# Altium schematic sheet Shifter.SchDoc
size B; SheetNumber: 2; SheetTotal: 2
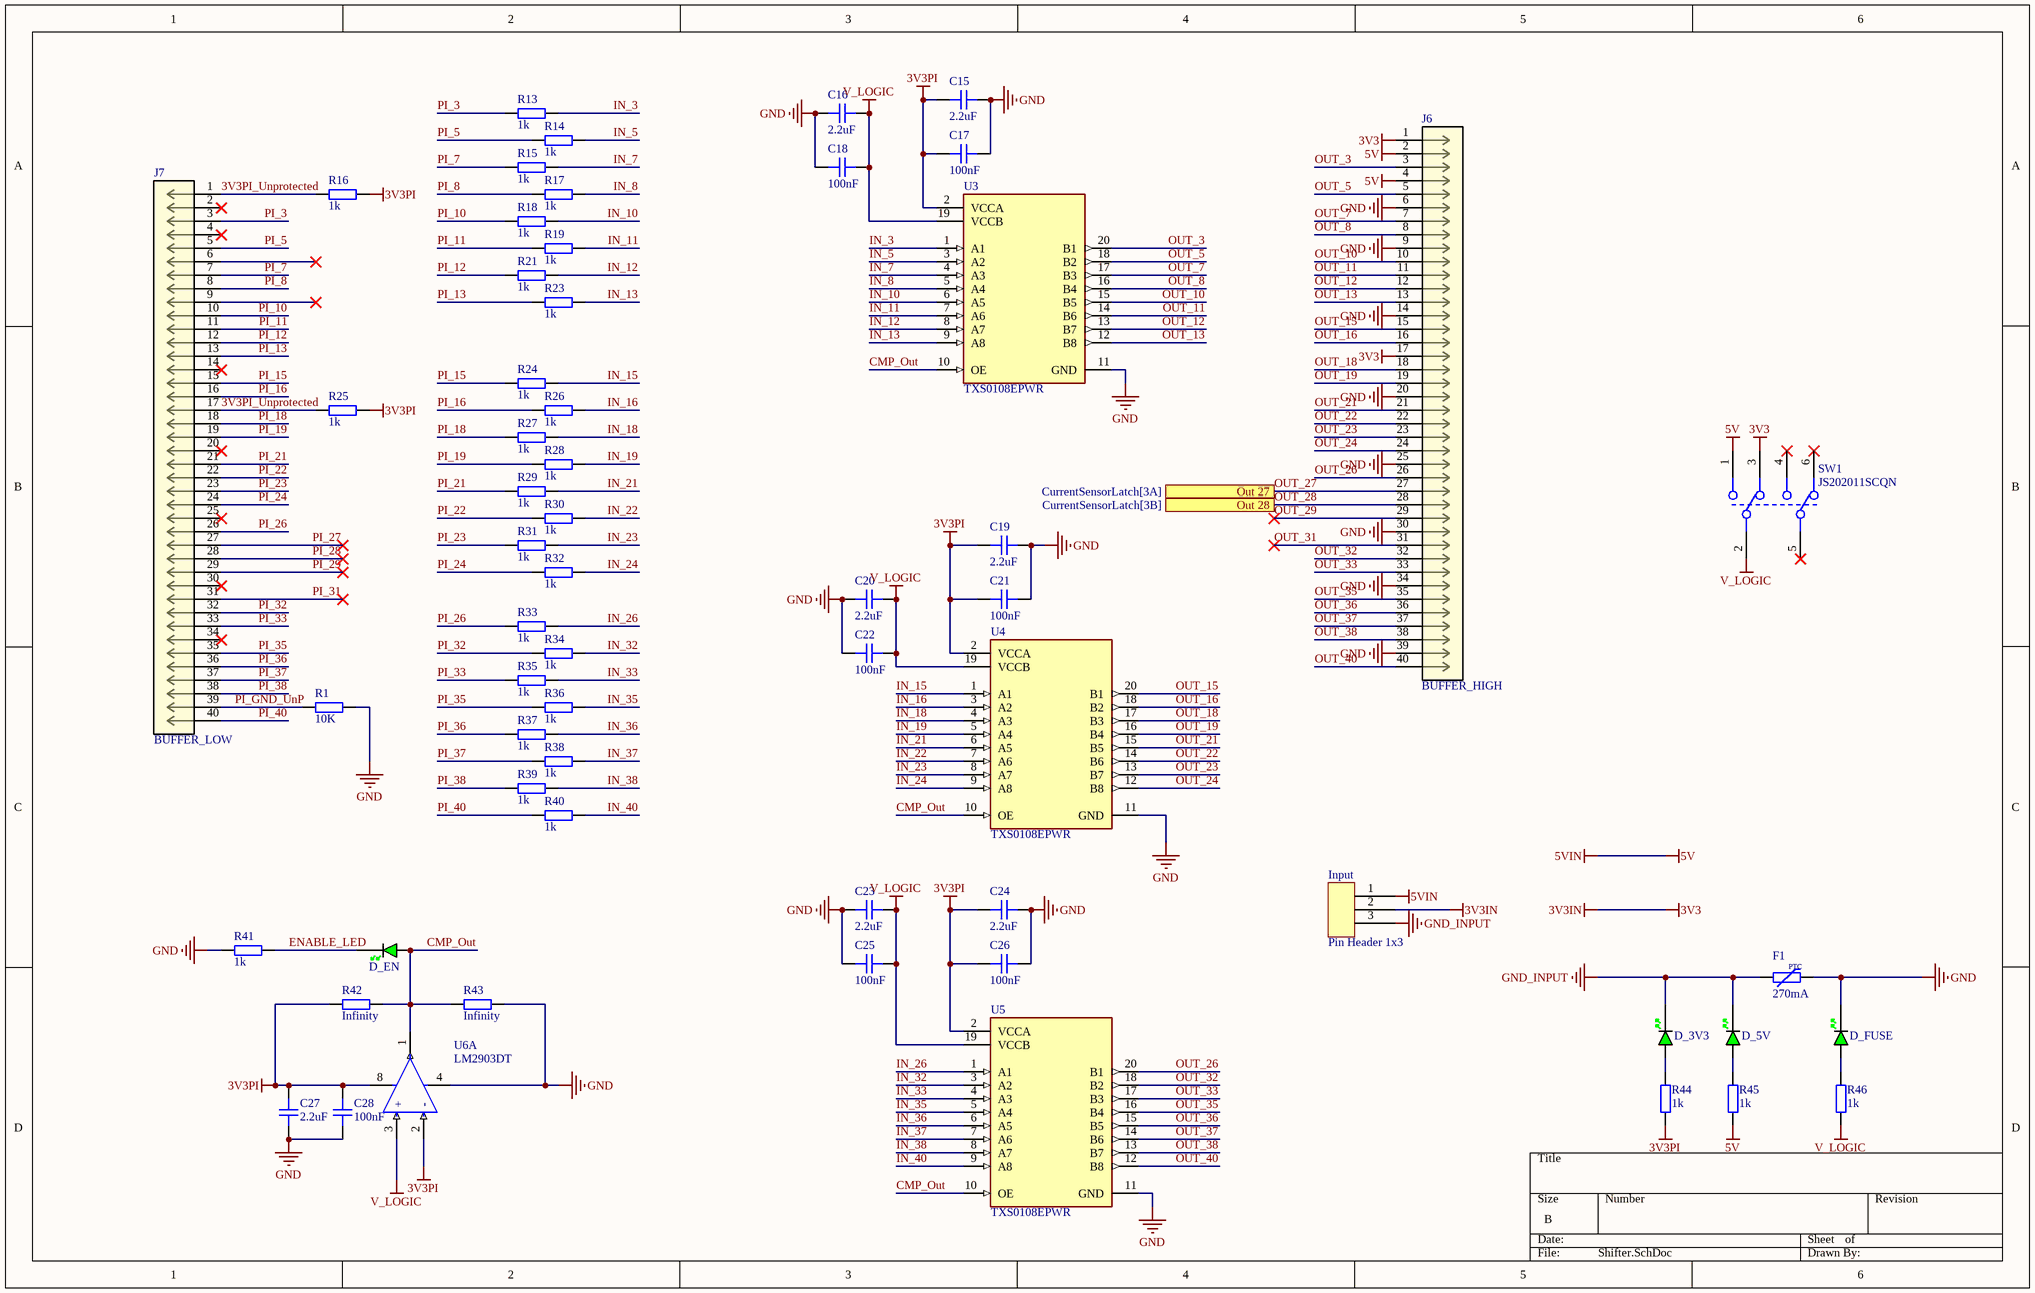
[diagram p0: Shifter.SchDoc]

## Parts
C15  2.2uF  [CAP_0805]
C16  2.2uF  [CAP_0805]
C17  100nF  [CAP_0805]
C18  100nF  [CAP_0805]
C19  2.2uF  [CAP_0805]
C20  2.2uF  [CAP_0805]
C21  100nF  [CAP_0805]
C22  100nF  [CAP_0805]
C23  2.2uF  [CAP_0805]
C24  2.2uF  [CAP_0805]
C25  100nF  [CAP_0805]
C26  100nF  [CAP_0805]
C27  2.2uF  [CAP_0805]
C28  100nF  [CAP_0805]
D_3V3  GREEN  [LED_0603_GREEN]  (value not drawn)
D_5V  GREEN  [LED_0603_GREEN]  (value not drawn)
D_EN  GREEN  [LED_0603_GREEN]  (value not drawn)
D_FUSE  GREEN  [LED_0603_GREEN]  (value not drawn)
F1  270mA  [FUSE_1206]
Input  Pin Header 1x3  [Pin Header 1x3]
J6  BUFFER_HIGH  [CONN_3020-40-0100-00_CNC]
J7  BUFFER_LOW  [CONN_3020-40-0100-00_CNC]
R1  10K  [RES_0603]
R13  1k  [RES_0603]
R14  1k  [RES_0603]
R15  1k  [RES_0603]
R16  1k  [RES_0603]
R17  1k  [RES_0603]
R18  1k  [RES_0603]
R19  1k  [RES_0603]
R21  1k  [RES_0603]
R23  1k  [RES_0603]
R24  1k  [RES_0603]
R25  1k  [RES_0603]
R26  1k  [RES_0603]
R27  1k  [RES_0603]
R28  1k  [RES_0603]
R29  1k  [RES_0603]
R30  1k  [RES_0603]
R31  1k  [RES_0603]
R32  1k  [RES_0603]
R33  1k  [RES_0603]
R34  1k  [RES_0603]
R35  1k  [RES_0603]
R36  1k  [RES_0603]
R37  1k  [RES_0603]
R38  1k  [RES_0603]
R39  1k  [RES_0603]
R40  1k  [RES_0603]
R41  1k  [RES_0603]
R42  Infinity  [RES_0603]
R43  Infinity  [RES_0603]
R44  1k  [RES_0603]
R45  1k  [RES_0603]
R46  1k  [RES_0603]
SW1  JS202011SCQN  [FP-JS202011SCQN-MFG]
U3  TXS0108EPWR  [FP-PW0020A-IPC_C]
U4  TXS0108EPWR  [FP-PW0020A-IPC_C]
U5  TXS0108EPWR  [FP-PW0020A-IPC_C]
U6  LM2903DT  [FP-SO8-SO-A-MFG]  (part A of 2)

## Ports
Out 27 (see CurrentSensorLatch[3A]), Out 28 (see CurrentSensorLatch[3B])

## Nets
3V3: Input.2 J6.1 J6.17 SW1.3  [also labelled 3V3IN]
3V3PI: C15.2 C17.2 C19.2 C21.2 C24.2 C26.2 C27.2 C28.1 R16.2 R25.2 R42.1 R44.1 U3.2(VCCA) U4.2(VCCA) U5.2(VCCA) U6.2(In1-) U6.8(VCC+)
5V: Input.1 J6.2 J6.4 R45.1 SW1.1  [also labelled 5VIN]
GND: C15.1 C16.2 C17.1 C18.2 C19.1 C20.2 C21.1 C22.2 C23.2 C24.1 C25.2 C26.1 C27.1 C28.2 D_FUSE.K F1.2 J6.6 J6.9 J6.14 J6.20 J6.25 J6.30 J6.34 J6.39 R1.2 R41.1 R43.2 U3.11(GND) U4.11(GND) U5.11(GND) U6.4(VCC-)
GND_INPUT: D_3V3.K D_5V.K F1.1 Input.3
V_LOGIC: C16.1 C18.1 C20.1 C22.1 C23.1 C25.1 R46.1 SW1.2 U3.19(VCCB) U4.19(VCCB) U5.19(VCCB) U6.3(In1+)
3V3PI_Unprotected: J7.1 J7.17 R16.1 R25.1
CMP_Out: D_EN.A R42.2 R43.1 U3.10(OE) U4.10(OE) U5.10(OE) U6.1(Out1)
ENABLE_LED: D_EN.K R41.2
IN_3: R13.2 U3.1(A1)
IN_5: R14.2 U3.3(A2)
IN_7: R15.2 U3.4(A3)
IN_8: R17.2 U3.5(A4)
IN_10: R18.2 U3.6(A5)
IN_11: R19.2 U3.7(A6)
IN_12: R21.2 U3.8(A7)
IN_13: R23.2 U3.9(A8)
IN_15: R24.2 U4.1(A1)
IN_16: R26.2 U4.3(A2)
IN_18: R27.2 U4.4(A3)
IN_19: R28.2 U4.5(A4)
IN_21: R29.2 U4.6(A5)
IN_22: R30.2 U4.7(A6)
IN_23: R31.2 U4.8(A7)
IN_24: R32.2 U4.9(A8)
IN_26: R33.2 U5.1(A1)
IN_32: R34.2 U5.3(A2)
IN_33: R35.2 U5.4(A3)
IN_35: R36.2 U5.5(A4)
IN_36: R37.2 U5.6(A5)
IN_37: R38.2 U5.7(A6)
IN_38: R39.2 U5.8(A7)
IN_40: R40.2 U5.9(A8)
OUT_3: J6.3 U3.20(B1)
OUT_5: J6.5 U3.18(B2)
OUT_7: J6.7 U3.17(B3)
OUT_8: J6.8 U3.16(B4)
OUT_10: J6.10 U3.15(B5)
OUT_11: J6.11 U3.14(B6)
OUT_12: J6.12 U3.13(B7)
OUT_13: J6.13 U3.12(B8)
OUT_15: J6.15 U4.20(B1)
OUT_16: J6.16 U4.18(B2)
OUT_18: J6.18 U4.17(B3)
OUT_19: J6.19 U4.16(B4)
OUT_21: J6.21 U4.15(B5)
OUT_22: J6.22 U4.14(B6)
OUT_23: J6.23 U4.13(B7)
OUT_24: J6.24 U4.12(B8)
OUT_26: J6.26 U5.20(B1)
OUT_27: J6.27 ; port Out 27
OUT_28: J6.28 ; port Out 28
OUT_29: J6.29
OUT_31: J6.31
OUT_32: J6.32 U5.18(B2)
OUT_33: J6.33 U5.17(B3)
OUT_35: J6.35 U5.16(B4)
OUT_36: J6.36 U5.15(B5)
OUT_37: J6.37 U5.14(B6)
OUT_38: J6.38 U5.13(B7)
OUT_40: J6.40 U5.12(B8)
PI_3: J7.3 R13.1
PI_5: J7.5 R14.1
PI_7: J7.7 R15.1
PI_8: J7.8 R17.1
PI_10: J7.10 R18.1
PI_11: J7.11 R19.1
PI_12: J7.12 R21.1
PI_13: J7.13 R23.1
PI_15: J7.15 R24.1
PI_16: J7.16 R26.1
PI_18: J7.18 R27.1
PI_19: J7.19 R28.1
PI_21: J7.21 R29.1
PI_22: J7.22 R30.1
PI_23: J7.23 R31.1
PI_24: J7.24 R32.1
PI_26: J7.26 R33.1
PI_27: J7.27
PI_28: J7.28
PI_29: J7.29
PI_31: J7.31
PI_32: J7.32 R34.1
PI_33: J7.33 R35.1
PI_35: J7.35 R36.1
PI_36: J7.36 R37.1
PI_37: J7.37 R38.1
PI_38: J7.38 R39.1
PI_40: J7.40 R40.1
PI_GND_UnP: J7.39 R1.1
NetD_3V3_A: D_3V3.A R44.2
NetD_5V_A: D_5V.A R45.2
NetD_FUSE_A: D_FUSE.A R46.2

Not connected (* = marked no-connect by the designer): J7 2* 4* 6* 9* 14* 20* 25* 30* 34*; SW1 4* 5* 6*

## Notes on the sheet
- (in symbol CMP-12132-000004-1, part A) +; -
- (in symbol FUSE_PPTC_1206) PTC

## Library data of the parts
C15-C28 = CAP_0805_16V: Capacitor SMD 0805 16V
D_3V3 D_5V D_EN D_FUSE = LED_0603_GREEN: LED 0603 GREEN SMD
F1 = FUSE_PPTC_1206: Fuse PPTC SMD 1206 / SMD1206B010TF; Manufacturer: *; Manufacturer Part Number: *
Input = Pin Header 1x3: .1" pitch pin header
J6 J7 = 3020-40-0100-00: No Description Available; Mfr_Name: CNC Tech; RefDes: RefDes; Type: Type
R1 R13-R19 R21 R23-R46 = RES_0603: Resistor SMD 0603; Manufacturer: *; Manufacturer Part Number: *; Distributor Link: *
SW1 = CMP-2000-05087-3: SWITCH SLIDE DPDT 300MA 6V; Switch Function: On-On; Actuator Type: Standard; Switch Travel: 2mm; Actuator Color: Black; Contact Resistance: 70mR; Electrical Life: 5000Cycles; Actuator Material: Nylon; REACH SVHC: No SVHC; Series: JS; Min Operating Temperature: -20°C; Depth: 7.5mm; Housing Material: Nylon; Voltage Rating (DC): 6V; Max Operating Temperature: 85°C; Contact Current Rating: 300mA; Package Quantity: 1; Contact Plating: Silver; Contact Material: Copper Alloy; Throw Configuration: DPDT; Current Rating: 300mA; Orientation: Vertical; Max Current Rating: 300mA; Max Voltage Rating (DC): 6V; Flammability Rating: UL94 V-2; Length: 9mm; Packaging: Tape and Reel; Mount: Surface Mount; Actuator Length: 2mm; Lead Free: Lead Free; Termination: Gull Wing; Radiation Hardening: No
U3-U5 = CMP-2000-04956-2: IC TRNSLTR BIDIRECTIONAL 20TSSOP; Number of Inputs: 8; Supply Current: 8uA; Low Level Output Current: 50mA; Min Supply Voltage: 1.2V; Quiescent Current: 3uA; Output Type: Voltage; Propagation Delay: 4.8ns; Max Supply Voltage: 5.5V; Output Current: 620uA; Turn-On Delay Time: 312ns; Logic Function: Translator; Data Rate: 60Mbps; Rise Time: 6.3ns; High Level Output Current: -50mA; Number of Pins: 20; Packaging: Tape and Reel; Max Operating Temperature: 85°C; Height: 1.15mm; Nominal Supply Current: 8uA; Termination: SMD/SMT; Lead Free: Lead Free; Package Quantity: 1; Number of Bits: 8; Weight: 0.002716oz; Contact Plating: Gold; Series: -; Width: 4.4mm; Radiation Hardening: No; Mount: Surface Mount; Length: 6.5mm; Case/Package: TSSOP; REACH SVHC: No SVHC; RoHS Compliant: Yes; Min Operating Temperature: -40°C; Number of Channels: 8
U6 = CMP-12132-000004-1: IC COMPARATOR LP DUAL 8-SOIC; Manufacturer: STMicroelectronics; Min Supply Voltage: 2V; Number Of Channels: 2; Input Offset Voltage: 1mV; Nominal Supply Current: 0.4-1mA; Output Current Per Channel: 16mA; Response Time: 1.3us; Voltage Gain: 200V/mV; Max Supply Voltage: 36V; Min Dual Supply Voltage: 1V; Standoff Height: 0.1mm; Input Bias Current: 0.025uA; Max Dual Supply Voltage: 18V; Max Junction Temp: +150°C; Height: 1.75mm; Device Class L2: Linear ICs; Temperature Range High: +150°C; Ambient Temperature Range Low: -40°C; Category: IC; Package: SO8-SO-A; Footprint Url: https://www.st.com/content/ccc/resource/technical/document/datasheet/group3/16/9a/68/4c/7d/03/4a/09/DM00396770/files/DM00396770.pdf/jcr:content/translations/en.DM00396770.pdf; Ipc Land Pattern Name: SOIC127P600X175-8; Octopart: https://octopart.com/lm2903dt-stmicroelectronics-428473; ComponentLink2URL: https://www.st.com/content/ccc/resource/technical/document/datasheet/44/f7/9d/99/42/20/45/fd/CD00000534.pdf/files/CD00000534.pdf/jcr:content/translations/en.CD00000534.pdf; Ambient Temperature Range High: +125°C; Device Class L1: Integrated Circuits (ICs); Device Class L3: Comparators; Digikey Description: IC COMPARATOR LP DUAL 8-SOIC; Automotive: No; ComponentLink2Description: Datasheet; Lead Free: Yes; Manufacturer Part Number: LM2903DT; Mouser Description: Analog Comparators Lo-Pwr Dual Voltage; Temperature: to +150°C; RoHS: TRUE